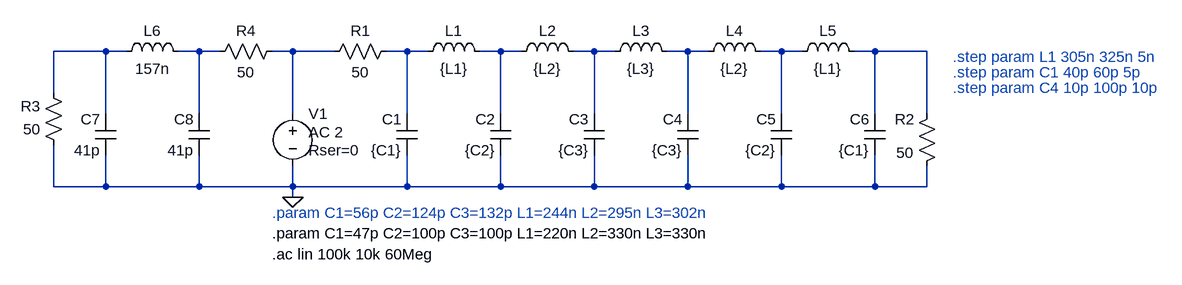
[diagram p0: schematic LowPass2.asc]
LowPass2.asc, the LTspice schematic file:
Version 4
SHEET 1 880 680
WIRE -2656 -320 -2736 -320
WIRE -2624 -320 -2656 -320
WIRE -2512 -320 -2544 -320
WIRE -2480 -320 -2512 -320
WIRE -2368 -320 -2400 -320
WIRE -2304 -320 -2368 -320
WIRE -2192 -320 -2224 -320
WIRE -2160 -320 -2192 -320
WIRE -2048 -320 -2080 -320
WIRE -2016 -320 -2048 -320
WIRE -1904 -320 -1936 -320
WIRE -1872 -320 -1904 -320
WIRE -1760 -320 -1792 -320
WIRE -1728 -320 -1760 -320
WIRE -1616 -320 -1648 -320
WIRE -1584 -320 -1616 -320
WIRE -1472 -320 -1504 -320
WIRE -1392 -320 -1472 -320
WIRE -2736 -256 -2736 -320
WIRE -2656 -224 -2656 -320
WIRE -2512 -224 -2512 -320
WIRE -2368 -224 -2368 -320
WIRE -2192 -224 -2192 -320
WIRE -2048 -224 -2048 -320
WIRE -1904 -224 -1904 -320
WIRE -1760 -224 -1760 -320
WIRE -1616 -224 -1616 -320
WIRE -1472 -224 -1472 -320
WIRE -1392 -224 -1392 -320
WIRE -2736 -112 -2736 -176
WIRE -2656 -112 -2656 -160
WIRE -2656 -112 -2736 -112
WIRE -2512 -112 -2512 -160
WIRE -2512 -112 -2656 -112
WIRE -2368 -112 -2368 -144
WIRE -2368 -112 -2512 -112
WIRE -2192 -112 -2192 -160
WIRE -2192 -112 -2368 -112
WIRE -2048 -112 -2048 -160
WIRE -2048 -112 -2192 -112
WIRE -1904 -112 -1904 -160
WIRE -1904 -112 -2048 -112
WIRE -1760 -112 -1760 -160
WIRE -1760 -112 -1904 -112
WIRE -1616 -112 -1616 -160
WIRE -1616 -112 -1760 -112
WIRE -1472 -112 -1472 -160
WIRE -1472 -112 -1616 -112
WIRE -1392 -112 -1392 -144
WIRE -1392 -112 -1472 -112
WIRE -2368 -96 -2368 -112
FLAG -2368 -96 0
SYMBOL ind -2176 -304 R270
WINDOW 0 32 56 VTop 2
WINDOW 3 5 56 VBottom 2
SYMATTR InstName L1
SYMATTR Value {L1}
SYMATTR SpiceLine Rser=.5
SYMBOL voltage -2368 -240 R0
WINDOW 3 24 44 Left 2
WINDOW 123 24 44 Left 2
WINDOW 39 24 72 Left 2
SYMATTR Value ""
SYMATTR Value2 AC 2
SYMATTR SpiceLine Rser=0
SYMATTR InstName V1
SYMBOL res -2320 -304 R270
WINDOW 0 32 56 VTop 2
WINDOW 3 0 56 VBottom 2
SYMATTR InstName R1
SYMATTR Value 50
SYMBOL cap -2176 -160 R180
WINDOW 0 24 56 Left 2
WINDOW 3 24 8 Left 2
SYMATTR InstName C1
SYMATTR Value {C1}
SYMBOL ind -1744 -304 R270
WINDOW 0 32 56 VTop 2
WINDOW 3 5 56 VBottom 2
SYMATTR InstName L4
SYMATTR Value {L2}
SYMATTR SpiceLine Rser=.62
SYMBOL cap -2032 -160 R180
WINDOW 0 24 56 Left 2
WINDOW 3 24 8 Left 2
SYMATTR InstName C2
SYMATTR Value {C2}
SYMBOL ind -1600 -304 R270
WINDOW 0 32 56 VTop 2
WINDOW 3 5 56 VBottom 2
SYMATTR InstName L5
SYMATTR Value {L1}
SYMATTR SpiceLine Rser=.5
SYMBOL cap -1600 -160 R180
WINDOW 0 24 56 Left 2
WINDOW 3 24 8 Left 2
SYMATTR InstName C5
SYMATTR Value {C2}
SYMBOL cap -1456 -160 R180
WINDOW 0 24 56 Left 2
WINDOW 3 24 8 Left 2
SYMATTR InstName C6
SYMATTR Value {C1}
SYMBOL res -1376 -240 M0
WINDOW 0 35 24 Left 2
SYMATTR InstName R2
SYMATTR Value 50
SYMBOL ind -2032 -304 R270
WINDOW 0 32 56 VTop 2
WINDOW 3 5 56 VBottom 2
SYMATTR InstName L2
SYMATTR Value {L2}
SYMATTR SpiceLine Rser=.62
SYMBOL cap -1888 -160 R180
WINDOW 0 24 56 Left 2
WINDOW 3 24 8 Left 2
SYMATTR InstName C3
SYMATTR Value {C3}
SYMBOL ind -1888 -304 R270
WINDOW 0 32 56 VTop 2
WINDOW 3 5 56 VBottom 2
SYMATTR InstName L3
SYMATTR Value {L3}
SYMATTR SpiceLine Rser=.62
SYMBOL cap -1744 -160 R180
WINDOW 0 24 56 Left 2
WINDOW 3 24 8 Left 2
SYMATTR InstName C4
SYMATTR Value {C3}
SYMBOL ind -2640 -304 R270
WINDOW 0 32 56 VTop 2
WINDOW 3 5 56 VBottom 2
SYMATTR InstName L6
SYMATTR Value 157n
SYMBOL res -2720 -160 R180
WINDOW 0 36 76 Left 2
WINDOW 3 36 40 Left 2
SYMATTR InstName R3
SYMATTR Value 50
SYMBOL cap -2640 -160 R180
WINDOW 0 24 56 Left 2
WINDOW 3 24 8 Left 2
SYMATTR InstName C7
SYMATTR Value 41p
SYMBOL cap -2496 -160 R180
WINDOW 0 24 56 Left 2
WINDOW 3 24 8 Left 2
SYMATTR InstName C8
SYMATTR Value 41p
SYMBOL res -2496 -304 R270
WINDOW 0 32 56 VTop 2
WINDOW 3 0 56 VBottom 2
SYMATTR InstName R4
SYMATTR Value 50
TEXT -2400 -8 Left 2 !.ac lin 100k 10k 60Meg
TEXT -2400 -72 Left 2 ;.param C1=56p C2=124p C3=132p L1=244n L2=295n L3=302n
TEXT -1352 -312 Left 2 ;.step param L1 305n 325n 5n
TEXT -1352 -288 Left 2 ;.step param C1 40p 60p 5p
TEXT -1352 -264 Left 2 ;.step param C4 10p 100p 10p
TEXT -2400 -40 Left 2 !.param C1=47p C2=100p C3=100p L1=220n L2=330n L3=330n

The netlist it stands for:
* LowPass2.asc
L1 N004 N005 {L1} Rser=.5
V1 N003 0 AC 2 Rser=0
R1 N003 N004 50
C1 0 N004 {C1}
L4 N007 N008 {L2} Rser=.62
C2 0 N005 {C2}
L5 N008 N009 {L1} Rser=.5
C5 0 N008 {C2}
C6 0 N009 {C1}
R2 N009 0 50
L2 N005 N006 {L2} Rser=.62
C3 0 N006 {C3}
L3 N006 N007 {L3} Rser=.62
C4 0 N007 {C3}
L6 N001 N002 157n
R3 0 N001 50
C7 0 N001 41p
C8 0 N002 41p
R4 N002 N003 50
.ac lin 100k 10k 60Meg
* .param C1=56p C2=124p C3=132p L1=244n L2=295n L3=302n
* .step param L1 305n 325n 5n
* .step param C1 40p 60p 5p
* .step param C4 10p 100p 10p
.param C1=47p C2=100p C3=100p L1=220n L2=330n L3=330n
.backanno
.end